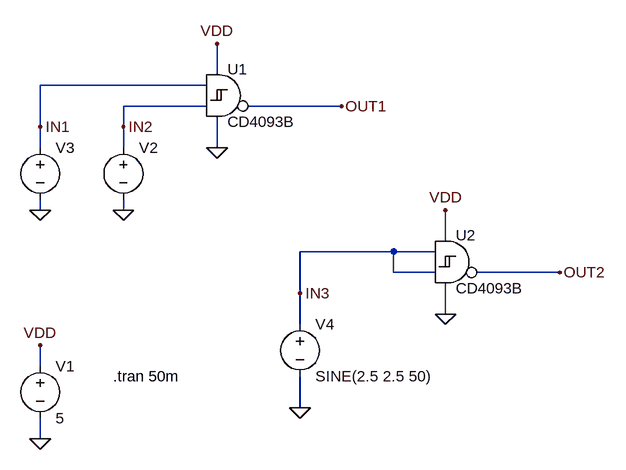
[diagram p0: schematic AND_CD4093B.asc]
AND_CD4093B.asc, the LTspice schematic file:
Version 4.1
SHEET 1 1108 724
WIRE 240 144 240 96
WIRE 224 160 -32 160
WIRE 224 192 96 192
WIRE 432 192 288 192
WIRE -32 224 -32 160
WIRE 96 224 96 192
WIRE -32 256 -32 224
WIRE 96 256 96 224
WIRE 240 256 240 208
WIRE -32 352 -32 336
WIRE 96 352 96 336
WIRE 592 400 592 352
WIRE 512 416 368 416
WIRE 576 416 512 416
WIRE 512 448 512 416
WIRE 576 448 512 448
WIRE 768 448 640 448
WIRE 368 480 368 416
WIRE 592 512 592 464
WIRE 368 528 368 480
WIRE -32 592 -32 560
WIRE 368 656 368 608
WIRE -32 704 -32 672
FLAG -32 704 0
FLAG -32 560 VDD
FLAG 240 96 VDD
FLAG 240 256 0
FLAG 432 192 OUT1
FLAG 96 352 0
FLAG -32 352 0
FLAG -32 224 IN1
FLAG 96 224 IN2
FLAG 592 352 VDD
FLAG 592 512 0
FLAG 368 656 0
FLAG 768 448 OUT2
FLAG 368 480 IN3
SYMBOL voltage -32 576 R0
WINDOW 123 0 0 Left 0
WINDOW 39 0 0 Left 0
SYMATTR InstName V1
SYMATTR Value 5
SYMBOL voltage 96 240 R0
WINDOW 3 -48 4 Invisible 2
WINDOW 123 0 0 Left 0
WINDOW 39 0 0 Left 0
SYMATTR Value PULSE(0 5 0 1n 1n {0.5/50} {1/50})
SYMATTR InstName V2
SYMBOL voltage -32 240 R0
WINDOW 3 -48 4 Invisible 2
WINDOW 123 0 0 Left 0
WINDOW 39 0 0 Left 0
SYMATTR Value PULSE(0 5 0 1n 1n {0.5/100} {1/100})
SYMATTR InstName V3
SYMBOL MyLib\\Digital\\CD4093B 256 112 R0
SYMATTR InstName U1
SYMBOL MyLib\\Digital\\CD4093B 608 368 R0
SYMATTR InstName U2
SYMBOL voltage 368 512 R0
WINDOW 123 0 0 Left 0
WINDOW 39 0 0 Left 0
SYMATTR InstName V4
SYMATTR Value SINE(2.5 2.5 50)
TEXT 80 608 Left 2 !.tran 50m

The netlist it stands for:
* AND_CD4093B.asc
V1 VDD 0 5
V2 IN2 0 PULSE(0 5 0 1n 1n {0.5/50} {1/50})
V3 IN1 0 PULSE(0 5 0 1n 1n {0.5/100} {1/100})
X§U1 IN1 IN2 OUT1 VDD 0 CD4093B vdd=5 speed=3 tripdt=40n  ; pins A B Y VDD GND
X§U2 IN3 IN3 OUT2 VDD 0 CD4093B vdd=5 speed=3 tripdt=40n  ; pins A B Y VDD GND
V4 IN3 0 SINE(2.5 2.5 50)
.tran 50m
.lib MyLib/Digital/_CD4xxx.lib
.backanno
.end